# Altium schematic sheet OVP_OIP_12V.SchDoc
size A4
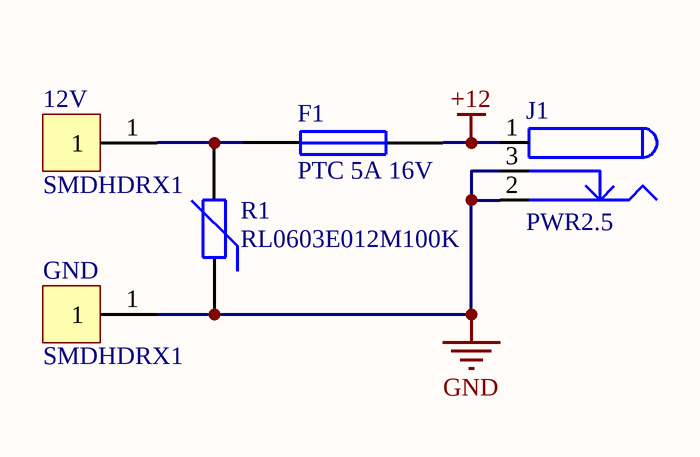
[diagram p0: OVP_OIP_12V.SchDoc]

## Parts
12V  SMDHDRX1  [SMDHDRX1_6*4]  (no BOM)
F1  PTC 5A 16V  [2920]
GND  SMDHDRX1  [SMDHDRX1_6*4]  (no BOM)
J1  PWR2.5  [DC005F]
R1  RL0603E012M100K  [0603_R]

## Nets
+12: F1.2 J1.1
GND: GND.1 J1.2 J1.3 R1.1
Net12V_1: 12V.1 F1.1 R1.2

## Library data of the parts
12V GND = SMDHDRX1: SMA and Hole
F1 = Fuse 1: Fuse; Published: 8-Jun-2000; LatestRevisionDate: 17-Jul-2002; LatestRevisionNote: Re-released for DXP Platform.; PackageReference: PIN-W2/E2.8; Publisher: Altium Limited; PackageDescription: Thru-Hole; 2 Leads
R1 = Res Varistor: Varistor (Voltage-Sensitive Resistor); Published: 24-Mar-1999; LatestRevisionDate: 29-May-2009; LatestRevisionNote: IPC-7351 Footprint Added.; PackageVersion: Mar-2003; PackageReference: 6-0805; Publisher: Altium Limited; PackageDescription: Chip Resistor 0805 Case Size; Code_IPC: RESC2012